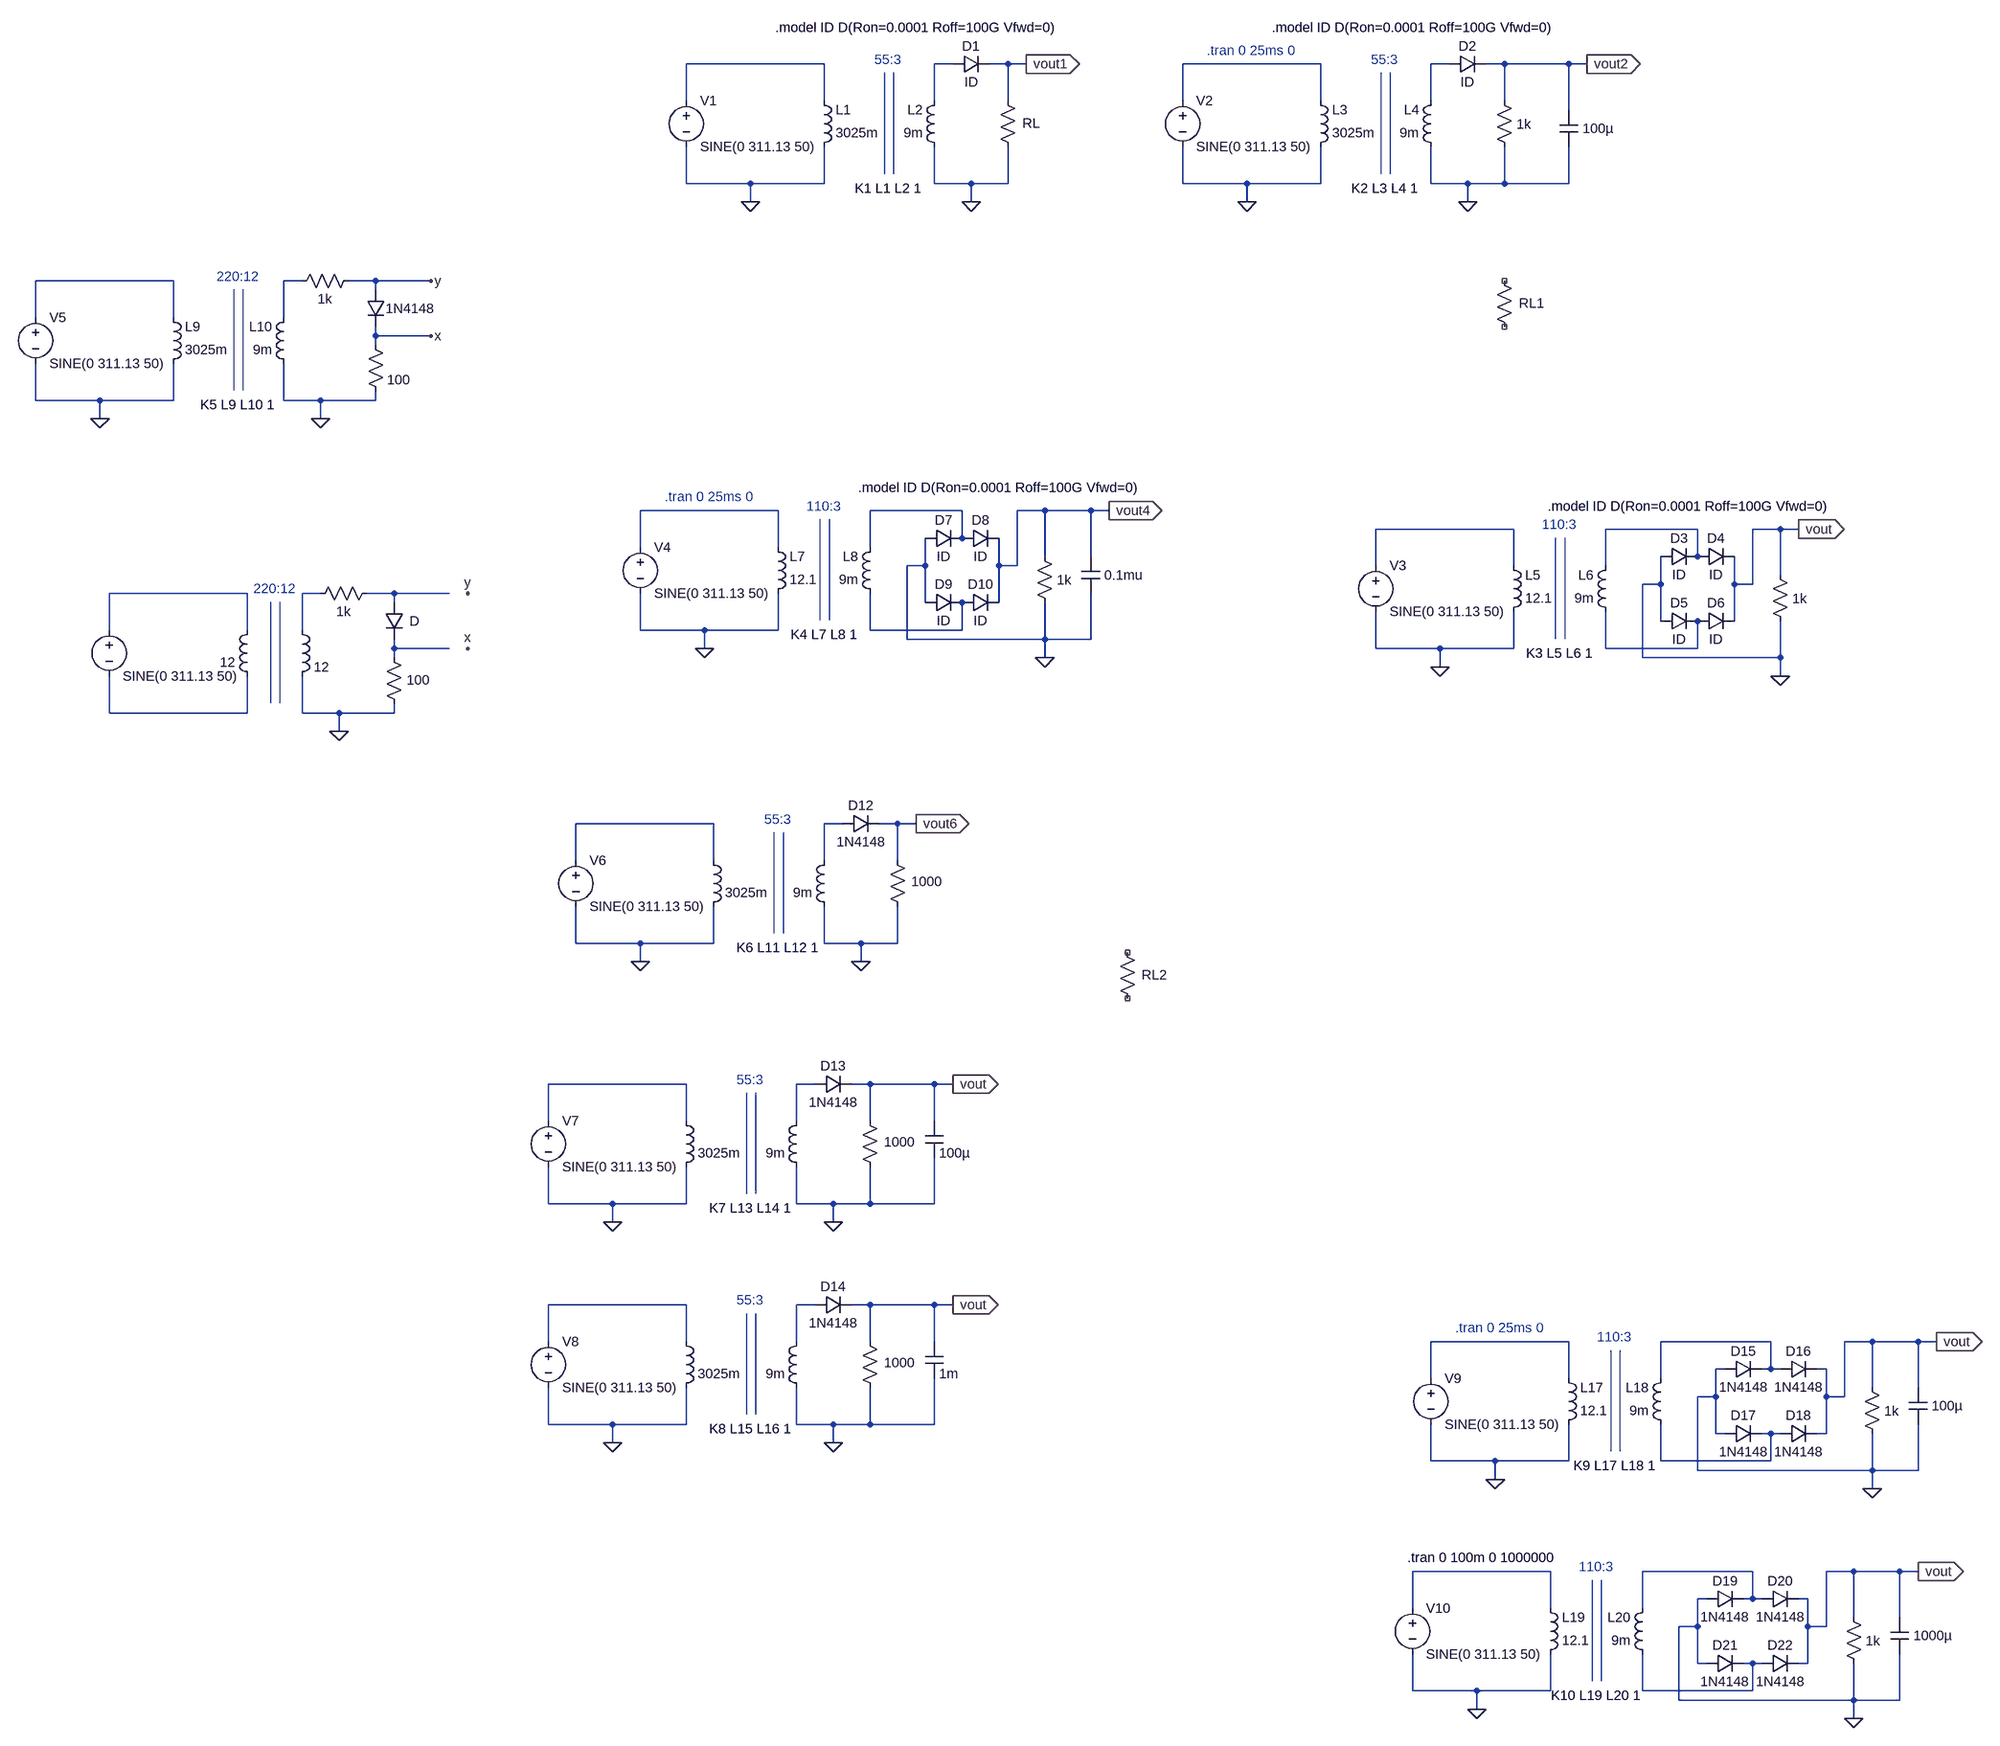
[diagram p0: schematic pre1.asc]
pre1.asc, the LTspice schematic file:
Version 4.1
SHEET 1 2312 3012
WIRE 240 64 0 64
WIRE 464 64 432 64
WIRE 560 64 528 64
WIRE 592 64 560 64
WIRE 1104 64 864 64
WIRE 1328 64 1296 64
WIRE 1424 64 1392 64
WIRE 1536 64 1424 64
WIRE 1568 64 1536 64
WIRE 0 128 0 64
WIRE 240 128 240 64
WIRE 432 128 432 64
WIRE 560 128 560 64
WIRE 864 128 864 64
WIRE 1104 128 1104 64
WIRE 1296 128 1296 64
WIRE 1424 128 1424 64
WIRE 1536 144 1536 64
WIRE 0 272 0 208
WIRE 112 272 0 272
WIRE 240 272 240 208
WIRE 240 272 112 272
WIRE 432 272 432 208
WIRE 496 272 432 272
WIRE 560 272 560 208
WIRE 560 272 496 272
WIRE 864 272 864 208
WIRE 976 272 864 272
WIRE 1104 272 1104 208
WIRE 1104 272 976 272
WIRE 1296 272 1296 208
WIRE 1360 272 1296 272
WIRE 1424 272 1424 208
WIRE 1424 272 1360 272
WIRE 1536 272 1536 208
WIRE 1536 272 1424 272
WIRE 112 304 112 272
WIRE 496 304 496 272
WIRE 976 304 976 272
WIRE 1360 304 1360 272
WIRE -1184 448 -1424 448
WIRE -960 448 -992 448
WIRE -832 448 -880 448
WIRE -736 448 -832 448
WIRE -832 464 -832 448
WIRE -1424 512 -1424 448
WIRE -1184 512 -1184 448
WIRE -992 512 -992 448
WIRE -832 544 -832 528
WIRE -736 544 -832 544
WIRE -832 560 -832 544
WIRE -1424 656 -1424 592
WIRE -1312 656 -1424 656
WIRE -1184 656 -1184 592
WIRE -1184 656 -1312 656
WIRE -992 656 -992 592
WIRE -928 656 -992 656
WIRE -832 656 -832 640
WIRE -832 656 -928 656
WIRE -1312 688 -1312 656
WIRE -928 688 -928 656
WIRE 160 848 -80 848
WIRE 480 848 320 848
WIRE 624 848 576 848
WIRE 704 848 624 848
WIRE 736 848 704 848
WIRE 1440 880 1200 880
WIRE 1760 880 1600 880
WIRE 1904 880 1856 880
WIRE 1936 880 1904 880
WIRE 480 896 480 848
WIRE -80 912 -80 848
WIRE 160 912 160 848
WIRE 320 912 320 848
WIRE 624 928 624 848
WIRE 704 928 704 848
WIRE 1760 928 1760 880
WIRE 416 944 416 896
WIRE 416 944 384 944
WIRE 544 944 544 896
WIRE 576 944 576 848
WIRE 576 944 544 944
WIRE 1200 944 1200 880
WIRE 1440 944 1440 880
WIRE 1600 944 1600 880
WIRE 1904 960 1904 880
WIRE 1696 976 1696 928
WIRE 1696 976 1664 976
WIRE 1824 976 1824 928
WIRE 1856 976 1856 880
WIRE 1856 976 1824 976
WIRE -1056 992 -1296 992
WIRE -928 992 -960 992
WIRE -800 992 -848 992
WIRE -704 992 -800 992
WIRE -800 1008 -800 992
WIRE 416 1008 416 944
WIRE 544 1008 544 944
WIRE 1696 1040 1696 976
WIRE 1824 1040 1824 976
WIRE -1296 1056 -1296 992
WIRE -1056 1056 -1056 992
WIRE -960 1056 -960 992
WIRE -80 1056 -80 992
WIRE 32 1056 -80 1056
WIRE 160 1056 160 992
WIRE 160 1056 32 1056
WIRE 320 1056 320 992
WIRE 480 1056 480 1008
WIRE 480 1056 320 1056
WIRE 384 1072 384 944
WIRE 624 1072 624 1008
WIRE 624 1072 384 1072
WIRE 704 1072 704 992
WIRE 704 1072 624 1072
WIRE -800 1088 -800 1072
WIRE -704 1088 -800 1088
WIRE 32 1088 32 1056
WIRE 1200 1088 1200 1024
WIRE 1312 1088 1200 1088
WIRE 1440 1088 1440 1024
WIRE 1440 1088 1312 1088
WIRE 1600 1088 1600 1024
WIRE 1760 1088 1760 1040
WIRE 1760 1088 1600 1088
WIRE -800 1104 -800 1088
WIRE 624 1104 624 1072
WIRE 1664 1104 1664 976
WIRE 1904 1104 1904 1040
WIRE 1904 1104 1664 1104
WIRE 1312 1120 1312 1088
WIRE 1904 1136 1904 1104
WIRE -1296 1200 -1296 1136
WIRE -1056 1200 -1056 1136
WIRE -1056 1200 -1296 1200
WIRE -960 1200 -960 1136
WIRE -896 1200 -960 1200
WIRE -800 1200 -800 1184
WIRE -800 1200 -896 1200
WIRE -896 1232 -896 1200
WIRE 48 1408 -192 1408
WIRE 272 1408 240 1408
WIRE 368 1408 336 1408
WIRE 400 1408 368 1408
WIRE -192 1472 -192 1408
WIRE 48 1472 48 1408
WIRE 240 1472 240 1408
WIRE 368 1472 368 1408
WIRE -192 1616 -192 1552
WIRE -80 1616 -192 1616
WIRE 48 1616 48 1552
WIRE 48 1616 -80 1616
WIRE 240 1616 240 1552
WIRE 304 1616 240 1616
WIRE 368 1616 368 1552
WIRE 368 1616 304 1616
WIRE -80 1648 -80 1616
WIRE 304 1648 304 1616
WIRE 0 1888 -240 1888
WIRE 224 1888 192 1888
WIRE 320 1888 288 1888
WIRE 432 1888 320 1888
WIRE 464 1888 432 1888
WIRE -240 1952 -240 1888
WIRE 0 1952 0 1888
WIRE 192 1952 192 1888
WIRE 320 1952 320 1888
WIRE 432 1952 432 1888
WIRE -240 2096 -240 2032
WIRE -128 2096 -240 2096
WIRE 0 2096 0 2032
WIRE 0 2096 -128 2096
WIRE 192 2096 192 2032
WIRE 256 2096 192 2096
WIRE 320 2096 320 2032
WIRE 320 2096 256 2096
WIRE 432 2096 432 2016
WIRE 432 2096 320 2096
WIRE -128 2128 -128 2096
WIRE 256 2128 256 2096
WIRE 0 2272 -240 2272
WIRE 224 2272 192 2272
WIRE 320 2272 288 2272
WIRE 432 2272 320 2272
WIRE 464 2272 432 2272
WIRE -240 2336 -240 2272
WIRE 0 2336 0 2272
WIRE 192 2336 192 2272
WIRE 320 2336 320 2272
WIRE 432 2336 432 2272
WIRE 1536 2336 1296 2336
WIRE 1888 2336 1696 2336
WIRE 2064 2336 2016 2336
WIRE 2144 2336 2064 2336
WIRE 2176 2336 2144 2336
WIRE 1808 2384 1792 2384
WIRE 1888 2384 1888 2336
WIRE 1888 2384 1872 2384
WIRE 1904 2384 1888 2384
WIRE 1984 2384 1968 2384
WIRE 1296 2400 1296 2336
WIRE 1536 2400 1536 2336
WIRE 1696 2400 1696 2336
WIRE 2064 2416 2064 2336
WIRE 2144 2416 2144 2336
WIRE 1792 2432 1792 2384
WIRE 1792 2432 1760 2432
WIRE 1984 2432 1984 2384
WIRE 2016 2432 2016 2336
WIRE 2016 2432 1984 2432
WIRE -240 2480 -240 2416
WIRE -128 2480 -240 2480
WIRE 0 2480 0 2416
WIRE 0 2480 -128 2480
WIRE 192 2480 192 2416
WIRE 256 2480 192 2480
WIRE 320 2480 320 2416
WIRE 320 2480 256 2480
WIRE 432 2480 432 2400
WIRE 432 2480 320 2480
WIRE 1792 2496 1792 2432
WIRE 1808 2496 1792 2496
WIRE 1888 2496 1872 2496
WIRE 1904 2496 1888 2496
WIRE 1984 2496 1984 2432
WIRE 1984 2496 1968 2496
WIRE -128 2512 -128 2480
WIRE 256 2512 256 2480
WIRE 1296 2544 1296 2480
WIRE 1408 2544 1296 2544
WIRE 1536 2544 1536 2480
WIRE 1536 2544 1408 2544
WIRE 1696 2544 1696 2480
WIRE 1888 2544 1888 2496
WIRE 1888 2544 1696 2544
WIRE 1760 2560 1760 2432
WIRE 2064 2560 2064 2496
WIRE 2064 2560 1760 2560
WIRE 2144 2560 2144 2480
WIRE 2144 2560 2064 2560
WIRE 1408 2576 1408 2544
WIRE 2064 2592 2064 2560
WIRE 1504 2736 1264 2736
WIRE 1856 2736 1664 2736
WIRE 2032 2736 1984 2736
WIRE 2112 2736 2032 2736
WIRE 2144 2736 2112 2736
WIRE 1776 2784 1760 2784
WIRE 1856 2784 1856 2736
WIRE 1856 2784 1840 2784
WIRE 1872 2784 1856 2784
WIRE 1952 2784 1936 2784
WIRE 1264 2800 1264 2736
WIRE 1504 2800 1504 2736
WIRE 1664 2800 1664 2736
WIRE 2032 2816 2032 2736
WIRE 2112 2816 2112 2736
WIRE 1760 2832 1760 2784
WIRE 1760 2832 1728 2832
WIRE 1952 2832 1952 2784
WIRE 1984 2832 1984 2736
WIRE 1984 2832 1952 2832
WIRE 1760 2896 1760 2832
WIRE 1776 2896 1760 2896
WIRE 1856 2896 1840 2896
WIRE 1872 2896 1856 2896
WIRE 1952 2896 1952 2832
WIRE 1952 2896 1936 2896
WIRE 1264 2944 1264 2880
WIRE 1376 2944 1264 2944
WIRE 1504 2944 1504 2880
WIRE 1504 2944 1376 2944
WIRE 1664 2944 1664 2880
WIRE 1856 2944 1856 2896
WIRE 1856 2944 1664 2944
WIRE 1728 2960 1728 2832
WIRE 2032 2960 2032 2896
WIRE 2032 2960 1728 2960
WIRE 2112 2960 2112 2880
WIRE 2112 2960 2032 2960
WIRE 1376 2976 1376 2944
WIRE 2032 2992 2032 2960
FLAG 112 304 0
FLAG 592 64 vout1
IOPIN 592 64 Out
FLAG 496 304 0
FLAG 976 304 0
FLAG 1568 64 vout2
IOPIN 1568 64 Out
FLAG 1360 304 0
FLAG 32 1088 0
FLAG 736 848 vout4
IOPIN 736 848 Out
FLAG 624 1104 0
FLAG 1312 1120 0
FLAG 1936 880 vout
IOPIN 1936 880 Out
FLAG 1904 1136 0
FLAG -1312 688 0
FLAG -928 688 0
FLAG -896 1232 0
FLAG -672 1088 x
FLAG -672 992 y
FLAG -80 1648 0
FLAG 400 1408 vout6
IOPIN 400 1408 Out
FLAG 304 1648 0
FLAG -736 544 x
FLAG -736 448 y
FLAG -128 2128 0
FLAG 464 1888 vout
IOPIN 464 1888 Out
FLAG 256 2128 0
FLAG -128 2512 0
FLAG 464 2272 vout
IOPIN 464 2272 Out
FLAG 256 2512 0
FLAG 1408 2576 0
FLAG 2176 2336 vout
IOPIN 2176 2336 Out
FLAG 2064 2592 0
FLAG 1376 2976 0
FLAG 2144 2736 vout
IOPIN 2144 2736 Out
FLAG 2032 2992 0
SYMBOL voltage 0 112 R0
WINDOW 39 0 0 Left 0
SYMATTR InstName V1
SYMATTR Value SINE(0 311.13 50)
SYMATTR Value2 AC 311
SYMBOL ind 224 224 M180
WINDOW 0 36 80 Left 2
WINDOW 3 36 40 Left 2
SYMATTR InstName L1
SYMATTR Value 3025m
SYMATTR SpiceLine Rser=.001
SYMBOL ind 448 224 R180
WINDOW 0 36 80 Left 2
WINDOW 3 36 40 Left 2
SYMATTR InstName L2
SYMATTR Value 9m
SYMBOL res 544 112 R0
WINDOW 0 41 55 Left 2
WINDOW 3 36 76 Invisible 2
SYMATTR InstName RL
SYMATTR Value 1k
SYMBOL diode 464 80 R270
WINDOW 0 32 32 VTop 2
WINDOW 3 0 32 VBottom 2
SYMATTR InstName D1
SYMATTR Value ID
SYMBOL voltage 864 112 R0
WINDOW 39 0 0 Left 0
SYMATTR InstName V2
SYMATTR Value SINE(0 311.13 50)
SYMATTR Value2 AC 311
SYMBOL ind 1088 224 M180
WINDOW 0 36 80 Left 2
WINDOW 3 36 40 Left 2
SYMATTR InstName L3
SYMATTR Value 3025m
SYMATTR SpiceLine Rser=.001
SYMBOL ind 1312 224 R180
WINDOW 0 36 80 Left 2
WINDOW 3 36 40 Left 2
SYMATTR InstName L4
SYMATTR Value 9m
SYMBOL res 1408 432 R0
WINDOW 0 41 55 Left 2
WINDOW 3 36 76 Invisible 2
SYMATTR InstName RL1
SYMATTR Value 1k
SYMBOL diode 1328 80 R270
WINDOW 0 32 32 VTop 2
WINDOW 3 0 32 VBottom 2
SYMATTR InstName D2
SYMATTR Value ID
SYMBOL cap 1520 144 R0
WINDOW 0 24 8 Invisible 2
WINDOW 3 40 32 Left 2
SYMATTR InstName C1
SYMATTR Value 100µ
SYMBOL res 1408 112 R0
WINDOW 0 36 40 Invisible 2
WINDOW 3 37 57 Left 2
SYMATTR InstName R1
SYMATTR Value 1k
SYMBOL voltage -80 896 R0
WINDOW 39 0 0 Left 0
SYMATTR InstName V4
SYMATTR Value SINE(0 311.13 50)
SYMATTR Value2 AC 311
SYMBOL ind 144 1008 M180
WINDOW 0 36 80 Left 2
WINDOW 3 36 40 Left 2
SYMATTR InstName L7
SYMATTR Value 12.1
SYMATTR SpiceLine Rser=.001
SYMBOL ind 336 1008 R180
WINDOW 0 36 80 Left 2
WINDOW 3 36 40 Left 2
SYMATTR InstName L8
SYMATTR Value 9m
SYMBOL cap 688 928 R0
WINDOW 0 24 8 Invisible 2
WINDOW 3 40 32 Left 2
SYMATTR InstName C2
SYMATTR Value 0.1mu
SYMBOL res 608 912 R0
WINDOW 0 36 40 Invisible 2
WINDOW 3 37 57 Left 2
SYMATTR InstName R2
SYMATTR Value 1k
SYMBOL diode 480 912 R270
WINDOW 0 32 32 VTop 2
WINDOW 3 0 32 VBottom 2
SYMATTR InstName D8
SYMATTR Value ID
SYMBOL diode 416 912 R270
WINDOW 0 32 32 VTop 2
WINDOW 3 0 32 VBottom 2
SYMATTR InstName D7
SYMATTR Value ID
SYMBOL diode 416 1024 R270
WINDOW 0 32 32 VTop 2
WINDOW 3 0 32 VBottom 2
SYMATTR InstName D9
SYMATTR Value ID
SYMBOL diode 480 1024 R270
WINDOW 0 32 32 VTop 2
WINDOW 3 0 32 VBottom 2
SYMATTR InstName D10
SYMATTR Value ID
SYMBOL voltage 1200 928 R0
WINDOW 39 0 0 Left 0
SYMATTR InstName V3
SYMATTR Value SINE(0 311.13 50)
SYMATTR Value2 AC 311
SYMBOL ind 1424 1040 M180
WINDOW 0 36 80 Left 2
WINDOW 3 36 40 Left 2
SYMATTR InstName L5
SYMATTR Value 12.1
SYMATTR SpiceLine Rser=.001
SYMBOL ind 1616 1040 R180
WINDOW 0 36 80 Left 2
WINDOW 3 36 40 Left 2
SYMATTR InstName L6
SYMATTR Value 9m
SYMBOL res 1888 944 R0
WINDOW 0 36 40 Invisible 2
WINDOW 3 37 57 Left 2
SYMATTR InstName R3
SYMATTR Value 1k
SYMBOL diode 1760 944 R270
WINDOW 0 32 32 VTop 2
WINDOW 3 0 32 VBottom 2
SYMATTR InstName D4
SYMATTR Value ID
SYMBOL diode 1696 944 R270
WINDOW 0 32 32 VTop 2
WINDOW 3 0 32 VBottom 2
SYMATTR InstName D3
SYMATTR Value ID
SYMBOL diode 1696 1056 R270
WINDOW 0 32 32 VTop 2
WINDOW 3 0 32 VBottom 2
SYMATTR InstName D5
SYMATTR Value ID
SYMBOL diode 1760 1056 R270
WINDOW 0 32 32 VTop 2
WINDOW 3 0 32 VBottom 2
SYMATTR InstName D6
SYMATTR Value ID
SYMBOL voltage -1424 496 R0
WINDOW 39 0 0 Left 0
SYMATTR InstName V5
SYMATTR Value SINE(0 311.13 50)
SYMATTR Value2 AC 311
SYMBOL ind -1200 608 M180
WINDOW 0 36 80 Left 2
WINDOW 3 36 40 Left 2
SYMATTR InstName L9
SYMATTR Value 3025m
SYMATTR SpiceLine Rser=.001
SYMBOL ind -976 608 R180
WINDOW 0 36 80 Left 2
WINDOW 3 36 40 Left 2
SYMATTR InstName L10
SYMATTR Value 9m
SYMBOL res -864 432 R90
WINDOW 0 0 56 Invisible 2
WINDOW 3 32 56 VTop 2
SYMATTR InstName R4
SYMATTR Value 1k
SYMBOL diode -848 464 R0
WINDOW 0 24 0 Invisible 2
WINDOW 3 33 32 Left 2
SYMATTR InstName D11
SYMATTR Value 1N4148
SYMBOL res -848 544 R0
WINDOW 0 36 40 Invisible 2
SYMATTR InstName R5
SYMATTR Value 100
SYMBOL res -832 976 R90
WINDOW 0 0 56 Invisible 2
WINDOW 3 32 56 VTop 2
SYMATTR InstName R6
SYMATTR Value 1k
SYMBOL res -816 1088 R0
WINDOW 0 36 40 Invisible 2
WINDOW 3 38 55 Left 2
SYMATTR InstName R7
SYMATTR Value 100
SYMBOL voltage -192 1456 R0
WINDOW 39 0 0 Left 0
SYMATTR InstName V6
SYMATTR Value SINE(0 311.13 50)
SYMATTR Value2 AC 311
SYMBOL ind 32 1568 M180
WINDOW 0 36 80 Invisible 2
WINDOW 3 36 40 Left 2
SYMATTR InstName L11
SYMATTR Value 3025m
SYMATTR SpiceLine Rser=.001
SYMBOL ind 256 1568 R180
WINDOW 0 36 80 Invisible 2
WINDOW 3 36 40 Left 2
SYMATTR InstName L12
SYMATTR Value 9m
SYMBOL res 752 1616 R0
WINDOW 0 41 55 Left 2
WINDOW 3 36 76 Invisible 2
SYMATTR InstName RL2
SYMATTR Value 1k
SYMBOL voltage -1296 1040 R0
WINDOW 39 0 0 Left 0
WINDOW 0 24 16 Invisible 2
SYMATTR InstName 1123
SYMATTR Value SINE(0 311.13 50)
SYMATTR Value2 AC 311
SYMBOL ind -1040 1152 R180
WINDOW 0 36 80 Invisible 2
WINDOW 3 36 40 Left 2
SYMATTR InstName 1231
SYMATTR Value 12
SYMBOL ind -976 1040 R0
WINDOW 0 36 40 Invisible 2
SYMATTR InstName 112314
SYMATTR Value 12
SYMBOL diode 272 1424 R270
WINDOW 0 32 32 VTop 2
WINDOW 3 0 32 VBottom 2
SYMATTR InstName D12
SYMATTR Value 1N4148
SYMBOL res 352 1456 R0
WINDOW 0 36 40 Invisible 2
WINDOW 3 40 53 Left 2
SYMATTR InstName R8
SYMATTR Value 1000
SYMBOL diode -816 1008 R0
WINDOW 0 24 0 Invisible 2
WINDOW 3 43 32 Left 2
SYMATTR InstName 124af
SYMBOL voltage -240 1936 R0
WINDOW 39 0 0 Left 0
SYMATTR InstName V7
SYMATTR Value SINE(0 311.13 50)
SYMATTR Value2 AC 311
SYMBOL ind -16 2048 M180
WINDOW 0 36 80 Invisible 2
WINDOW 3 36 40 Left 2
SYMATTR InstName L13
SYMATTR Value 3025m
SYMATTR SpiceLine Rser=.001
SYMBOL ind 208 2048 R180
WINDOW 0 36 80 Invisible 2
WINDOW 3 36 40 Left 2
SYMATTR InstName L14
SYMATTR Value 9m
SYMBOL diode 224 1904 R270
WINDOW 0 32 32 VTop 2
WINDOW 3 0 32 VBottom 2
SYMATTR InstName D13
SYMATTR Value 1N4148
SYMBOL res 304 1936 R0
WINDOW 0 36 40 Invisible 2
WINDOW 3 40 53 Left 2
SYMATTR InstName R9
SYMATTR Value 1000
SYMBOL cap 416 1952 R0
WINDOW 0 24 8 Invisible 2
SYMATTR InstName C3
SYMATTR Value 100µ
SYMBOL voltage -240 2320 R0
WINDOW 39 0 0 Left 0
SYMATTR InstName V8
SYMATTR Value SINE(0 311.13 50)
SYMATTR Value2 AC 311
SYMBOL ind -16 2432 M180
WINDOW 0 36 80 Invisible 2
WINDOW 3 36 40 Left 2
SYMATTR InstName L15
SYMATTR Value 3025m
SYMATTR SpiceLine Rser=.001
SYMBOL ind 208 2432 R180
WINDOW 0 36 80 Invisible 2
WINDOW 3 36 40 Left 2
SYMATTR InstName L16
SYMATTR Value 9m
SYMBOL diode 224 2288 R270
WINDOW 0 32 32 VTop 2
WINDOW 3 0 32 VBottom 2
SYMATTR InstName D14
SYMATTR Value 1N4148
SYMBOL res 304 2320 R0
WINDOW 0 36 40 Invisible 2
WINDOW 3 40 53 Left 2
SYMATTR InstName R10
SYMATTR Value 1000
SYMBOL cap 416 2336 R0
WINDOW 0 24 8 Invisible 2
SYMATTR InstName C4
SYMATTR Value 1m
SYMBOL voltage 1296 2384 R0
WINDOW 39 0 0 Left 0
SYMATTR InstName V9
SYMATTR Value SINE(0 311.13 50)
SYMATTR Value2 AC 311
SYMBOL ind 1520 2496 M180
WINDOW 0 36 80 Left 2
WINDOW 3 36 40 Left 2
SYMATTR InstName L17
SYMATTR Value 12.1
SYMATTR SpiceLine Rser=.001
SYMBOL ind 1712 2496 R180
WINDOW 0 36 80 Left 2
WINDOW 3 36 40 Left 2
SYMATTR InstName L18
SYMATTR Value 9m
SYMBOL cap 2128 2416 R0
WINDOW 0 24 8 Invisible 2
WINDOW 3 40 32 Left 2
SYMATTR InstName C5
SYMATTR Value 100µ
SYMBOL res 2048 2400 R0
WINDOW 0 36 40 Invisible 2
WINDOW 3 37 57 Left 2
SYMATTR InstName R11
SYMATTR Value 1k
SYMBOL diode 1808 2400 R270
WINDOW 0 32 32 VTop 2
WINDOW 3 0 32 VBottom 2
SYMATTR InstName D15
SYMATTR Value 1N4148
SYMBOL diode 1904 2400 R270
WINDOW 0 32 32 VTop 2
WINDOW 3 0 32 VBottom 2
SYMATTR InstName D16
SYMATTR Value 1N4148
SYMBOL diode 1808 2512 R270
WINDOW 0 32 32 VTop 2
WINDOW 3 0 32 VBottom 2
SYMATTR InstName D17
SYMATTR Value 1N4148
SYMBOL diode 1904 2512 R270
WINDOW 0 32 32 VTop 2
WINDOW 3 0 32 VBottom 2
SYMATTR InstName D18
SYMATTR Value 1N4148
SYMBOL voltage 1264 2784 R0
WINDOW 39 0 0 Left 0
SYMATTR InstName V10
SYMATTR Value SINE(0 311.13 50)
SYMATTR Value2 AC 311
SYMBOL ind 1488 2896 M180
WINDOW 0 36 80 Left 2
WINDOW 3 36 40 Left 2
SYMATTR InstName L19
SYMATTR Value 12.1
SYMATTR SpiceLine Rser=.001
SYMBOL ind 1680 2896 R180
WINDOW 0 36 80 Left 2
WINDOW 3 36 40 Left 2
SYMATTR InstName L20
SYMATTR Value 9m
SYMBOL cap 2096 2816 R0
WINDOW 0 24 8 Invisible 2
WINDOW 3 40 32 Left 2
SYMATTR InstName C6
SYMATTR Value 1000µ
SYMBOL res 2016 2800 R0
WINDOW 0 36 40 Invisible 2
WINDOW 3 37 57 Left 2
SYMATTR InstName R12
SYMATTR Value 1k
SYMBOL diode 1776 2800 R270
WINDOW 0 32 32 VTop 2
WINDOW 3 0 32 VBottom 2
SYMATTR InstName D19
SYMATTR Value 1N4148
SYMBOL diode 1872 2800 R270
WINDOW 0 32 32 VTop 2
WINDOW 3 0 32 VBottom 2
SYMATTR InstName D20
SYMATTR Value 1N4148
SYMBOL diode 1776 2912 R270
WINDOW 0 32 32 VTop 2
WINDOW 3 0 32 VBottom 2
SYMATTR InstName D21
SYMATTR Value 1N4148
SYMBOL diode 1872 2912 R270
WINDOW 0 32 32 VTop 2
WINDOW 3 0 32 VBottom 2
SYMATTR InstName D22
SYMATTR Value 1N4148
TEXT 328 56 Left 2 ;55:3
TEXT 400 0 Center 2 !.model ID D(Ron=0.0001 Roff=100G Vfwd=0)
TEXT 1192 56 Left 2 ;55:3
TEXT 1216 280 Center 2 !K2 L3 L4 1
TEXT 984 40 Center 2 ;.tran 0 25ms 0
TEXT 1264 0 Center 2 !.model ID D(Ron=0.0001 Roff=100G Vfwd=0)
TEXT 240 840 Center 2 ;110:3
TEXT 240 1064 Center 2 !K4 L7 L8 1
TEXT 40 824 Center 2 ;.tran 0 25ms 0
TEXT 544 808 Center 2 !.model ID D(Ron=0.0001 Roff=100G Vfwd=0)
TEXT 1520 872 Center 2 ;110:3
TEXT 1520 1096 Center 2 !K3 L5 L6 1
TEXT 1744 840 Center 2 !.model ID D(Ron=0.0001 Roff=100G Vfwd=0)
TEXT 352 280 Center 2 !K1 L1 L2 1
TEXT -1072 440 Center 2 ;220:12
TEXT -1072 664 Center 2 !K5 L9 L10 1
TEXT -1008 984 Center 2 ;220:12
TEXT 136 1400 Left 2 ;55:3
TEXT 160 1624 Center 2 !K6 L11 L12 1
TEXT 88 1880 Left 2 ;55:3
TEXT 112 2104 Center 2 !K7 L13 L14 1
TEXT 88 2264 Left 2 ;55:3
TEXT 112 2488 Center 2 !K8 L15 L16 1
TEXT 1616 2328 Center 2 ;110:3
TEXT 1616 2552 Center 2 !K9 L17 L18 1
TEXT 1416 2312 Center 2 ;.tran 0 25ms 0
TEXT 1584 2728 Center 2 ;110:3
TEXT 1584 2952 Center 2 !K10 L19 L20 1
TEXT 1384 2712 Center 2 !.tran 0 100m 0 1000000
LINE Normal 345 255 345 79
LINE Normal 361 255 361 79
LINE Normal 1209 255 1209 79
LINE Normal 1225 255 1225 79
LINE Normal 233 1039 233 863
LINE Normal 249 1039 249 863
LINE Normal 1513 1071 1513 895
LINE Normal 1529 1071 1529 895
LINE Normal -1079 639 -1079 463
LINE Normal -1063 639 -1063 463
LINE Normal -1015 1183 -1015 1007
LINE Normal -999 1183 -999 1007
LINE Normal 153 1599 153 1423
LINE Normal 169 1599 169 1423
LINE Normal 105 2079 105 1903
LINE Normal 121 2079 121 1903
LINE Normal 105 2463 105 2287
LINE Normal 121 2463 121 2287
LINE Normal 1609 2527 1609 2351
LINE Normal 1625 2527 1625 2351
LINE Normal 1577 2927 1577 2751
LINE Normal 1593 2927 1593 2751

The netlist it stands for:
* pre1.asc
V1 N001 0 SINE(0 311.13 50) AC 311
L1 0 N001 3025m Rser=.001
L2 0 N002 9m
RL vout1 0 1k
D1 N002 vout1 ID
V2 N003 0 SINE(0 311.13 50) AC 311
L3 0 N003 3025m Rser=.001
L4 0 N004 9m
RL1 NC_01 NC_02 1k
D2 N004 vout2 ID
C1 vout2 0 100µ
R1 vout2 0 1k
V4 N007 0 SINE(0 311.13 50) AC 311
L7 0 N007 12.1 Rser=.001
L8 N014 N008 9m
C2 vout4 0 0.1mu
R2 vout4 0 1k
D8 N008 vout4 ID
D7 0 N008 ID
D9 0 N014 ID
D10 N014 vout4 ID
V3 N009 0 SINE(0 311.13 50) AC 311
L5 0 N009 12.1 Rser=.001
L6 N016 N010 9m
R3 vout 0 1k
D4 N010 vout ID
D3 0 N010 ID
D5 0 N016 ID
D6 N016 vout ID
V5 N005 0 SINE(0 311.13 50) AC 311
L9 0 N005 3025m Rser=.001
L10 0 N006 9m
R4 y N006 1k
D11 y x 1N4148
R5 x 0 100
R6 N013 N012 1k
R7 N015 0 100
V6 N018 0 SINE(0 311.13 50) AC 311
L11 0 N018 3025m Rser=.001
L12 0 N019 9m
RL2 NC_03 NC_04 1k
V§1123 N011 N017 SINE(0 311.13 50) AC 311
L§1231 N017 N011 12
L§112314 N012 0 12
D12 N019 vout6 1N4148
R8 vout6 0 1000
D§124af N013 N015 D
V7 N020 0 SINE(0 311.13 50) AC 311
L13 0 N020 3025m Rser=.001
L14 0 N021 9m
D13 N021 vout 1N4148
R9 vout 0 1000
C3 vout 0 100µ
V8 N022 0 SINE(0 311.13 50) AC 311
L15 0 N022 3025m Rser=.001
L16 0 N023 9m
D14 N023 vout 1N4148
R10 vout 0 1000
C4 vout 0 1m
V9 N024 0 SINE(0 311.13 50) AC 311
L17 0 N024 12.1 Rser=.001
L18 N026 N025 9m
C5 vout 0 100µ
R11 vout 0 1k
D15 0 N025 1N4148
D16 N025 vout 1N4148
D17 0 N026 1N4148
D18 N026 vout 1N4148
V10 N027 0 SINE(0 311.13 50) AC 311
L19 0 N027 12.1 Rser=.001
L20 N029 N028 9m
C6 vout 0 1000µ
R12 vout 0 1k
D19 0 N028 1N4148
D20 N028 vout 1N4148
D21 0 N029 1N4148
D22 N029 vout 1N4148
.model D D
.lib standard.dio
* 55:3
.model ID D(Ron=0.0001 Roff=100G Vfwd=0)
* 55:3
K2 L3 L4 1
* .tran 0 25ms 0
.model ID D(Ron=0.0001 Roff=100G Vfwd=0)
* 110:3
K4 L7 L8 1
* .tran 0 25ms 0
.model ID D(Ron=0.0001 Roff=100G Vfwd=0)
* 110:3
K3 L5 L6 1
.model ID D(Ron=0.0001 Roff=100G Vfwd=0)
K1 L1 L2 1
* 220:12
K5 L9 L10 1
* 220:12
* 55:3
K6 L11 L12 1
* 55:3
K7 L13 L14 1
* 55:3
K8 L15 L16 1
* 110:3
K9 L17 L18 1
* .tran 0 25ms 0
* 110:3
K10 L19 L20 1
.tran 0 100m 0 1000000
.backanno
.end